# EAGLE board xmos_avb_brd_V4 (EAGLE 9.6.2)
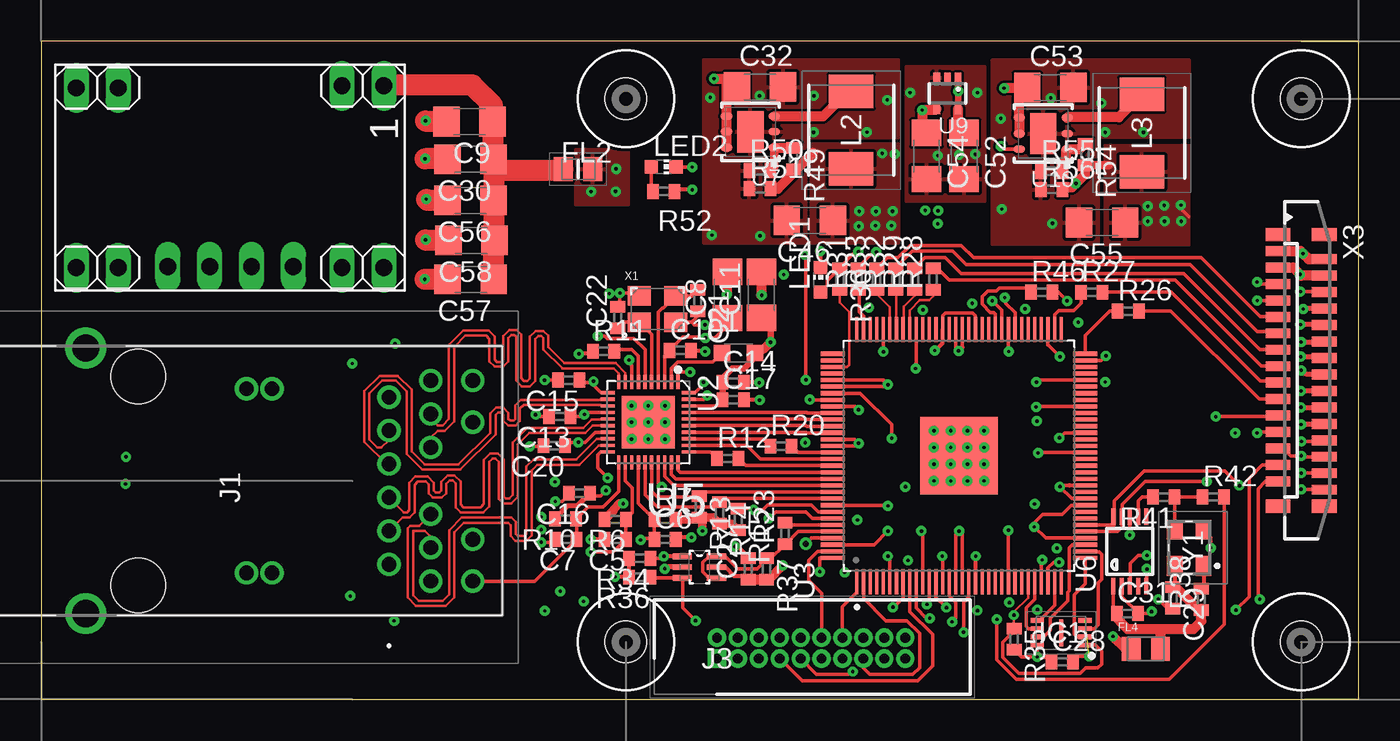
[diagram p4: board, top side]
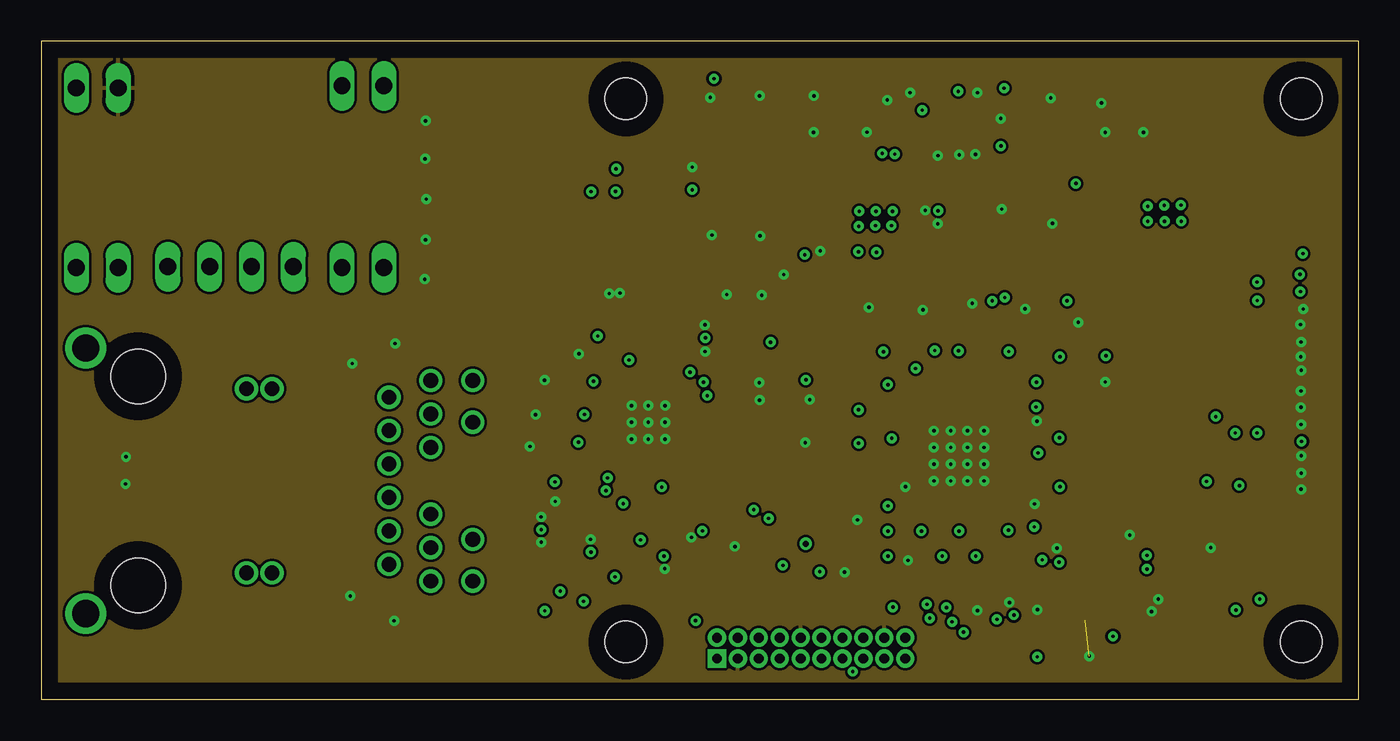
[diagram p5: board, inner layer LAYER2]
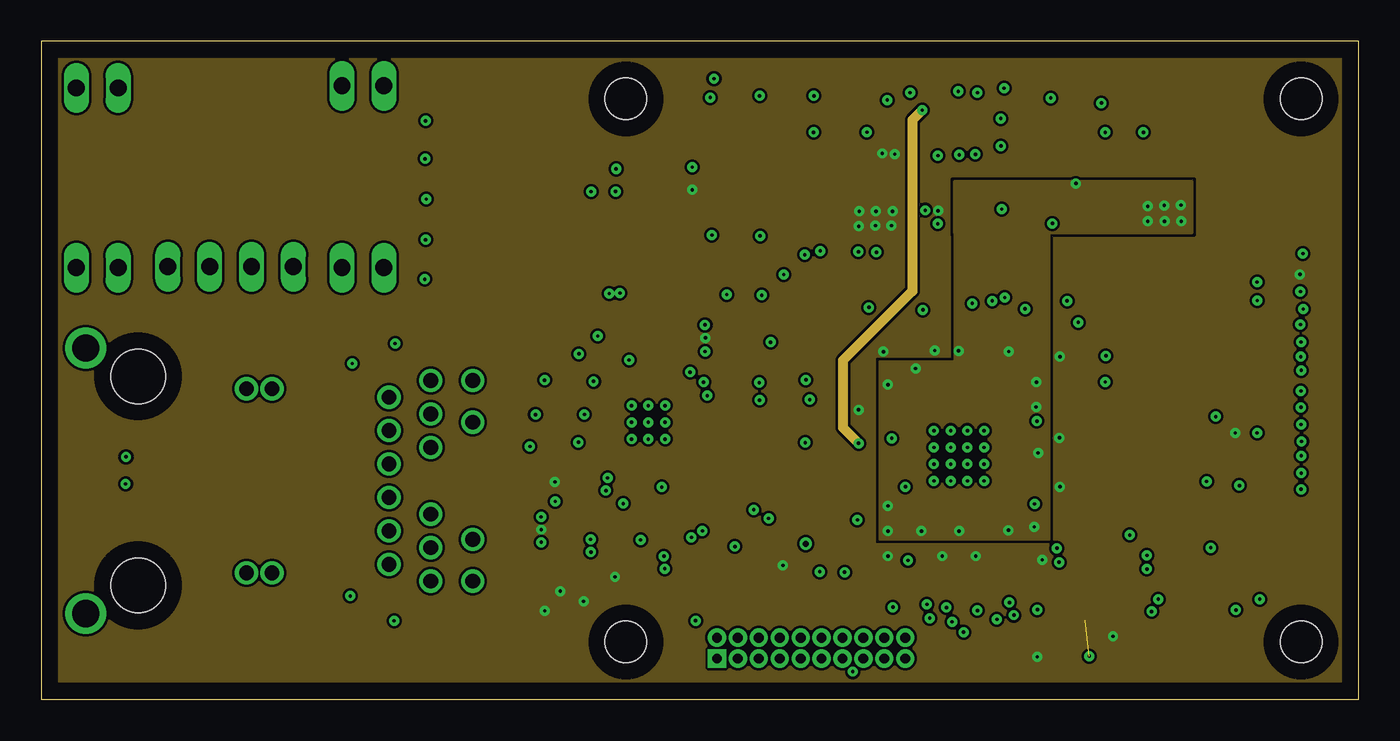
[diagram p6: board, inner layer LAYER15]
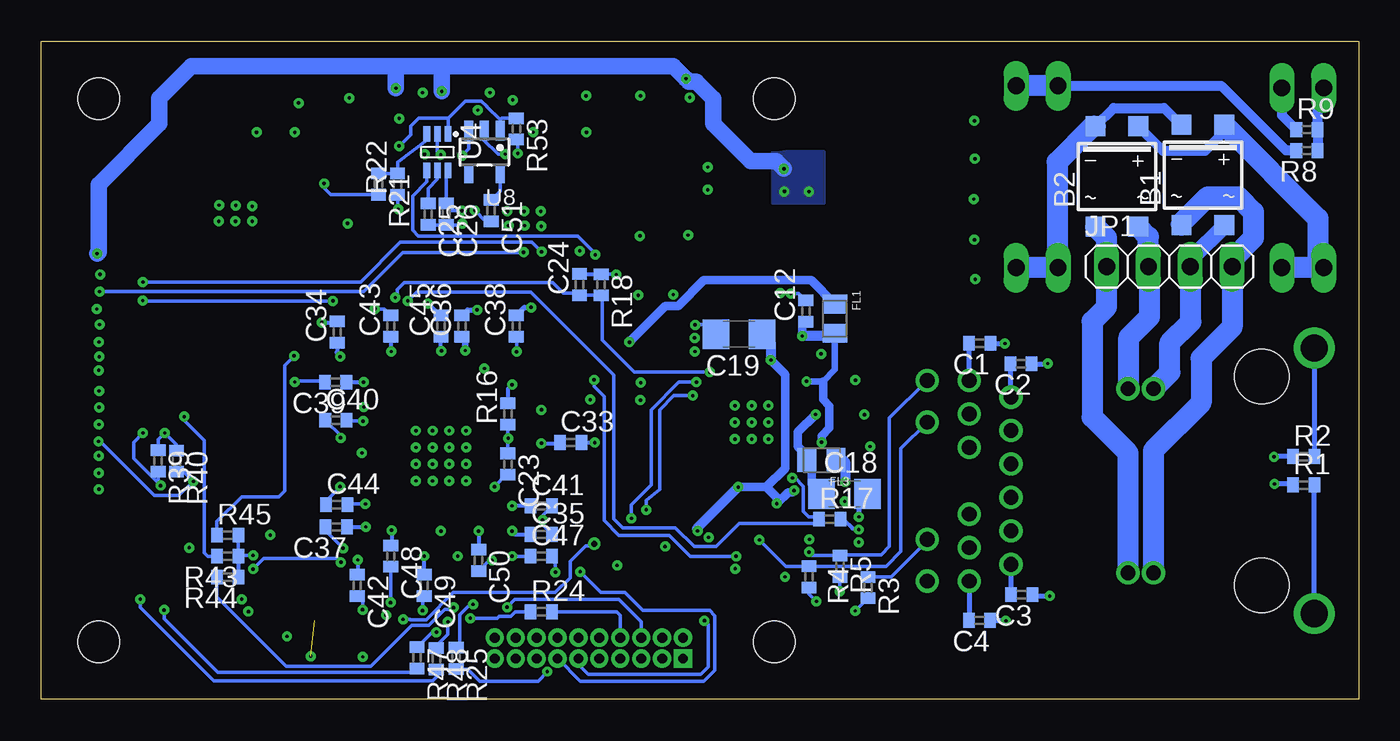
[diagram p7: board, bottom side, seen from below]

Size 80 x 40 mm. Coordinates in mm from the lower left corner, seen from the top.
Outline: 0,0 80,0 80,40 0,40 0,0
Copper layers (1+2*15+16): Top 0.035mm / dielectric 0.14mm / LAYER2 0.035mm / dielectric 1.2mm / LAYER15 0.035mm / dielectric 0.14mm / Bottom 0.035mm
Design rules "4layer_pcbPool *": minimum track width 0.15mm, minimum drill 0.2mm, track to track 6mil, track to pad 6mil, pad to pad 6mil, via to via 6mil, smd to smd 6mil, copper to edge 40mil, drill to drill 8mil, minimum pad ring 10mil, minimum via ring 8mil, stop-mask expansion 4mil, vias tented up to drill 0.7mm, thermal gap 8mil
Net classes: 0 default: width 0.2 mm, drill 0.2 mm; 1 GND: width 0.2 mm, drill 0.2 mm; 2 diff pairs: width 0.15 mm, drill 0.2 mm; 3 PWR: width 0.2 mm, drill 0.2 mm

## Footprints (pad centres in the part's own frame; a part is rotated, then mirrored left to right if it is on the bottom)
RECTIFIER_SOIC-4 = smd 1.2 x 1.2: + 1.3,3.05; - -1.3,3.05; ~1 -1.3,-3.05; ~2 1.3,-3.05
RCL_C0402 = smd 0.7 x 0.9: 1 -0.65,0; 2 0.65,0
RCL_C1206 = smd 1.6 x 1.8: 1 -1.4,0; 2 1.4,0
BLM21AG471SN1D_BEADC2012X105N = smd 1.14 x 1.47: 1 -0.89,0; 2 0.89,0
BLM21PG331SN1D_BEADC2012X105N = smd 1.15 x 1.45: 1 -0.9,0; 2 0.9,0
IS25LP080D-JULE-TR_SON50P300X200X55-9N = smd 0.8 x 0.3: 1 -1.45,0.75; 2 -1.45,0.25; 3 -1.45,-0.25; 4 -1.45,-0.75; 5 1.45,-0.75; 6 1.45,-0.25; 7 1.45,0.25; 8 1.45,0.75 | smd 0.25 x 1.65: 9 0,0
0826-1X1T-KL-F_08261X1TKLF = drill 0.9 pad 1.27: 1 5.08,15.24; 2 3.048,15.24; 3 1.016,15.24; 4 -1.016,15.24; 5 -3.048,15.24; 6 -5.08,15.24; 7 6.096,17.78; 8 4.064,17.78; 9 2.032,17.78; 10 -2.032,17.78; 11 -4.064,17.78; 12 -6.096,17.78; 13 5.59,8.13; 14 -5.59,8.13; 15 5.59,6.59; 16 -5.59,6.59; 17 6.096,20.32; 18 3.556,20.32; 19 -3.556,20.32; 20 -6.096,20.32 | drill 1.65 pad 2.475: MH1 8.065,-3.18; MH2 -8.065,-3.18 | hole 3.3: 6.35,0; -6.35,0
SHDR20W41P127_2X10_1905X559X54 = drill 0.6 pad 1 square: 1 0,0 | drill 0.6 pad 1: 2 0,1.27; 3 1.27,0; 4 1.27,1.27; 5 2.54,0; 6 2.54,1.27; 7 3.81,0; 8 3.81,1.27; 9 5.08,0; 10 5.08,1.27; 11 6.35,0; 12 6.35,1.27; 13 7.62,0; 14 7.62,1.27; 15 8.89,0; 16 8.89,1.27; 17 10.16,0; 18 10.16,1.27; 19 11.43,0; 20 11.43,1.27
PINHEAD_1X04 = drill 1.016 long: 1 -3.81,0; 2 -1.27,0; 3 1.27,0; 4 3.81,0
RCL_L2012C = smd 1 x 1: 1 -1,0; 2 1,0
IHLP2020BZER2R2M11_INDPM5552X200N = smd 2.05 x 2.7: 1 -2.35,0; 2 2.35,0
LED_CHIP-LED0603 = smd 0.8 x 0.8: A 0,-0.75; C 0,0.75
RCL_R0402 = smd 0.7 x 0.9: 1 -0.65,0; 2 0.65,0
AG9900_AG9900LP = drill 1.016 long: 1 -19.939,-3.175; 2 -17.399,-3.175; 3 -3.81,-3.048; 4 -1.27,-3.048; 5 -1.27,7.874; 6 -3.81,7.874; 7 -17.399,7.874; 8 -19.939,7.874
AR8035_QFN40P500X500X75-41N = smd 0.85 x 0.2: 1 -2.45,1.8; 2 -2.45,1.4; 3 -2.45,1; 4 -2.45,0.6; 5 -2.45,0.2; 6 -2.45,-0.2; 7 -2.45,-0.6; 8 -2.45,-1; 9 -2.45,-1.4; 10 -2.45,-1.8; 21 2.45,-1.8; 22 2.45,-1.4; 23 2.45,-1; 24 2.45,-0.6; 25 2.45,-0.2; 26 2.45,0.2; 27 2.45,0.6; 28 2.45,1; 29 2.45,1.4; 30 2.45,1.8 | smd 0.2 x 0.85: 11 -1.8,-2.45; 12 -1.4,-2.45; 13 -1,-2.45; 14 -0.6,-2.45; 15 -0.2,-2.45; 16 0.2,-2.45; 17 0.6,-2.45; 18 1,-2.45; 19 1.4,-2.45; 20 1.8,-2.45; 31 1.8,2.45; 32 1.4,2.45; 33 1,2.45; 34 0.6,2.45; 35 0.2,2.45; 36 -0.2,2.45; 37 -0.6,2.45; 38 -1,2.45; 39 -1.4,2.45; 40 -1.8,2.45 | smd 3.2 x 3.2: 41 0,0
XE216-512-TQ128-C20_QFP40P1600X1600X120-129N = smd 1.47 x 0.2: 1 -7.67,6.2; 2 -7.67,5.8; 3 -7.67,5.4; 4 -7.67,5; 5 -7.67,4.6; 6 -7.67,4.2; 7 -7.67,3.8; 8 -7.67,3.4; 9 -7.67,3; 10 -7.67,2.6; 11 -7.67,2.2; 12 -7.67,1.8; 13 -7.67,1.4; 14 -7.67,1; 15 -7.67,0.6; 16 -7.67,0.2; 17 -7.67,-0.2; 18 -7.67,-0.6; 19 -7.67,-1; 20 -7.67,-1.4; 21 -7.67,-1.8; 22 -7.67,-2.2; 23 -7.67,-2.6; 24 -7.67,-3; 25 -7.67,-3.4; 26 -7.67,-3.8; 27 -7.67,-4.2; 28 -7.67,-4.6; 29 -7.67,-5; 30 -7.67,-5.4; 31 -7.67,-5.8; 32 -7.67,-6.2; 65 7.67,-6.2; 66 7.67,-5.8; 67 7.67,-5.4; 68 7.67,-5; 69 7.67,-4.6; 70 7.67,-4.2; 71 7.67,-3.8; 72 7.67,-3.4; 73 7.67,-3; 74 7.67,-2.6; 75 7.67,-2.2; 76 7.67,-1.8; 77 7.67,-1.4; 78 7.67,-1; 79 7.67,-0.6; 80 7.67,-0.2; 81 7.67,0.2; 82 7.67,0.6; 83 7.67,1; 84 7.67,1.4; 85 7.67,1.8; 86 7.67,2.2; 87 7.67,2.6; 88 7.67,3; 89 7.67,3.4; 90 7.67,3.8; 91 7.67,4.2; 92 7.67,4.6; 93 7.67,5; 94 7.67,5.4; 95 7.67,5.8; 96 7.67,6.2 | smd 0.2 x 1.47: 33 -6.2,-7.67; 34 -5.8,-7.67; 35 -5.4,-7.67; 36 -5,-7.67; 37 -4.6,-7.67; 38 -4.2,-7.67; 39 -3.8,-7.67; 40 -3.4,-7.67; 41 -3,-7.67; 42 -2.6,-7.67; 43 -2.2,-7.67; 44 -1.8,-7.67; 45 -1.4,-7.67; 46 -1,-7.67; 47 -0.6,-7.67; 48 -0.2,-7.67; 49 0.2,-7.67; 50 0.6,-7.67; 51 1,-7.67; 52 1.4,-7.67; 53 1.8,-7.67; 54 2.2,-7.67; 55 2.6,-7.67; 56 3,-7.67; 57 3.4,-7.67; 58 3.8,-7.67; 59 4.2,-7.67; 60 4.6,-7.67; 61 5,-7.67; 62 5.4,-7.67; 63 5.8,-7.67; 64 6.2,-7.67; 97 6.2,7.67; 98 5.8,7.67; 99 5.4,7.67; 100 5,7.67; 101 4.6,7.67; 102 4.2,7.67; 103 3.8,7.67; 104 3.4,7.67; 105 3,7.67; 106 2.6,7.67; 107 2.2,7.67; 108 1.8,7.67; 109 1.4,7.67; 110 1,7.67; 111 0.6,7.67; 112 0.2,7.67; 113 -0.2,7.67; 114 -0.6,7.67; 115 -1,7.67; 116 -1.4,7.67; 117 -1.8,7.67; 118 -2.2,7.67; 119 -2.6,7.67; 120 -3,7.67; 121 -3.4,7.67; 122 -3.8,7.67; 123 -4.2,7.67; 124 -4.6,7.67; 125 -5,7.67; 126 -5.4,7.67; 127 -5.8,7.67; 128 -6.2,7.67 | smd 4.7 x 4.7: 129 0,0
ADM1085AKSZ-REEL7_SOP65P210X95-6N = smd 0.95 x 0.4: 1 -1.1,0.65; 2 -1.1,0; 3 -1.1,-0.65; 4 1.1,-0.65; 5 1.1,0; 6 1.1,0.65
NC7WZ07P6X_SOT65P210X110-6N = smd 1.168 x 0.356: 1 -1.041,0.66; 2 -1.041,0; 3 -1.041,-0.66; 4 1.041,-0.66; 5 1.041,0; 6 1.041,0.66
CS2100-CP_CIRRUS-LOGIC_MSOP10 = smd 0.25 x 1: 1 -1,-2.113; 2 -0.5,-2.113; 3 0,-2.113; 4 0.5,-2.113; 5 1,-2.113; 6 1,2.113; 7 0.5,2.113; 8 0,2.113; 9 -0.5,2.113; 10 -1,2.113
ST-MICROELECTRONICS2_DFN6 = smd 0.45 x 0.7: 1 -0.95,-1.45; 2 0,-1.45; 3 0.95,-1.45; 4 0.95,1.45; 5 0,1.45; 6 -0.95,1.45 | smd 2.5 x 1.6: 7 0,0
ON-SEMI_SOT23-5 = smd 0.55 x 1.2: 1 -0.95,-1.3; 2 0,-1.3; 3 0.95,-1.3; 4 0.95,1.3; 5 -0.95,1.3
MICREL2_SC70-5 = smd 0.4 x 0.6: 1 -0.65,-0.95; 2 0,-0.95; 3 0.65,-0.95; 4 0.65,0.95; 5 -0.65,0.95
DRIL-2,5 = hole 2.5: 0,0
FA-238_OSCCC320X250X70-4N = smd 1.4 x 1.2: 1 -1.1,-0.8; 2 1.1,-0.8; 3 1.1,0.8; 4 -1.1,0.8
CON-MOLEX_52559-3092 = smd 0.6 x 1.5: 1 -7.25,-1.4; 2 -6.75,1.4; 3 -6.25,-1.4; 4 -5.75,1.4; 5 -5.25,-1.4; 6 -4.75,1.4; 7 -4.25,-1.4; 8 -3.75,1.4; 9 -3.25,-1.4; 10 -2.75,1.4; 11 -2.25,-1.4; 12 -1.75,1.4; 13 -1.25,-1.4; 14 -0.75,1.4; 15 -0.25,-1.4; 16 0.25,1.4; 17 0.75,-1.4; 18 1.25,1.4; 19 1.75,-1.4; 20 2.25,1.4; 21 2.75,-1.4; 22 3.25,1.4; 23 3.75,-1.4; 24 4.25,1.4; 25 4.75,-1.4; 26 5.25,1.4; 27 5.75,-1.4; 28 6.25,1.4; 29 6.75,-1.4; 30 7.25,1.4 | smd 0.8 x 1.5: M1 -8.25,-1.4; M2 8.25,-1.4; M3 8.25,1.4; M4 -8.25,1.4
ECS-3225Q-33-240-DP-TR_ECS3225Q33240DPTR = smd 1.2 x 0.95: 1 -1.1,-0.875; 2 1.1,-0.875; 3 1.1,0.875; 4 -1.1,0.875

## Placement (x,y rotation side)
B1  RECTIFIER_MB1S  [RECTIFIER_SOIC-4]  9.47,31.87 0 bottom
B2  RECTIFIER_MB1S  [RECTIFIER_SOIC-4]  14.69,31.78 0 bottom
C1  100n  [RCL_C0402]  23.01,21.64 180 bottom
C2  100n  [RCL_C0402]  20.51,20.4 180 bottom
C3  100n  [RCL_C0402]  20.47,6.37 180 bottom
C4  100n  [RCL_C0402]  23.03,4.81 180 bottom
C5  470p  [RCL_C0402]  34.85,9.73 180 top
C6  470p  [RCL_C0402]  37.88,9.73 0 top
C7  470p  [RCL_C0402]  31.86,9.73 180 top
C8  10u  [RCL_C1206]  41.67,24.58 90 top
C9  1u  [RCL_C1206]  26.01,35.11 180 top
C10  100n  [RCL_C0402]  38.81,21.21 0 top
C11  10u  [RCL_C1206]  43.72,24.59 90 top
C12  100n  [RCL_C0402]  33.57,23.59 90 bottom
C13  100n  [RCL_C0402]  31.49,17.2 180 top
C14  100n  [RCL_C0402]  42.02,19.28 0 top
C15  100n  [RCL_C0402]  32.04,19.41 180 top
C16  100n  [RCL_C0402]  32.68,12.54 180 top
C17  100n  [RCL_C0402]  42.02,18.21 0 top
C18  1u  [RCL_C1206]  31.23,12.49 0 bottom
C19  1u  [RCL_C1206]  37.64,22.2 180 bottom
C20  100n  [RCL_C0402]  31.15,15.43 180 top
C21  27p  [RCL_C0402]  39.87,24.24 270 top
C22  27p  [RCL_C0402]  35,23.22 90 top
C23  100n  [RCL_C0402]  51.66,14.3 270 bottom
C24  100n  [RCL_C0402]  47.32,25.22 90 bottom
C25  1n  [RCL_C0402]  56.5,29.48 270 bottom
C26  100n  [RCL_C0402]  55.41,29.49 270 bottom
C27  100n  [RCL_C0402]  42.93,7.93 90 top
C28  100n  [RCL_C0402]  61.99,2.29 0 top
C29  100n  [RCL_C0402]  68.71,6.17 270 top
C30  1u  [RCL_C1206]  26.06,32.82 180 top
C31  100n  [RCL_C0402]  65.96,5.23 0 top
C32  4u7  [RCL_C1206]  43.64,37.21 0 top
C33  100n  [RCL_C0402]  47.85,15.62 0 bottom
C34  100n  [RCL_C0402]  62.03,22.33 90 bottom
C35  100n  [RCL_C0402]  49.63,10.03 0 bottom
C36  100n  [RCL_C0402]  54.46,22.68 90 bottom
C37  100n  [RCL_C0402]  62.08,10.49 180 bottom
C38  100n  [RCL_C0402]  51.16,22.68 90 bottom
C39  100n  [RCL_C0402]  62.13,19.28 180 bottom
C40  100n  [RCL_C0402]  62.1,16.97 0 bottom
C41  100n  [RCL_C0402]  49.63,11.76 0 bottom
C42  100n  [RCL_C0402]  60.81,6.93 270 bottom
C43  100n  [RCL_C0402]  58.78,22.68 90 bottom
C44  100n  [RCL_C0402]  62.05,11.84 0 bottom
C45  100n  [RCL_C0402]  55.73,22.68 90 bottom
C46  22u  [RCL_C1206]  46.67,29.1 180 top
C47  100n  [RCL_C0402]  49.63,8.71 0 bottom
C48  100n  [RCL_C0402]  58.78,8.71 270 bottom
C49  100n  [RCL_C0402]  56.74,6.93 270 bottom
C50  100n  [RCL_C0402]  53.44,8.46 270 bottom
C51  1n  [RCL_C0402]  52.68,29.7 270 bottom
C52  1u  [RCL_C1206]  56.04,33.02 270 top
C53  4u7  [RCL_C1206]  61.27,37.18 0 top
C54  1u  [RCL_C1206]  53.75,33.02 270 top
C55  22u  [RCL_C1206]  64.42,28.98 180 top
C56  1u  [RCL_C1206]  26.07,30.32 180 top
C57  1u  [RCL_C1206]  26.08,25.52 180 top
C58  1u  [RCL_C1206]  26.12,27.89 180 top
FL1  BLM21AG471SN1D_BLM21AG471SN1D  [BLM21AG471SN1D_BEADC2012X105N]  31.81,23.14 270 bottom
FL2  BLM21PG331SN1D_BLM21PG331SN1D  [BLM21PG331SN1D_BEADC2012X105N]  32.6,32.22 180 top
FL3  BLM21AG471SN1D_BLM21AG471SN1D  [BLM21AG471SN1D_BEADC2012X105N]  32.63,14.56 180 bottom
FL4  BLM21AG471SN1D_BLM21AG471SN1D  [BLM21AG471SN1D_BEADC2012X105N]  67.07,3.07 0 top
IC1  IS25LP080D-JULE-TR_IS25LP080D-JULE-TR  [IS25LP080D-JULE-TR_SON50P300X200X55-9N]  61.93,4.06 180 top
J1  0826-1X1T-KL-F_0826-1X1T-KL-F  [0826-1X1T-KL-F_08261X1TKLF]  5.88,13.29 270 top
J3  ESHF-110-01-L-D-TH  [SHDR20W41P127_2X10_1905X559X54]  41.03,2.49 0 top
JP1  [PINHEAD_1X04]  11.5,26.3 0 bottom
L1  4u7  [RCL_L2012C]  42.34,21.05 0 top
L2  IHLP2020BZER2R2M11_IHLP2020BZER2R2M11  [IHLP2020BZER2R2M11_INDPM5552X200N]  49.18,34.59 270 top
L3  IHLP2020BZER2R2M11_IHLP2020BZER2R2M11  [IHLP2020BZER2R2M11_INDPM5552X200N]  66.83,34.41 270 top
LED1  gre  [LED_CHIP-LED0603]  47.32,25.5 0 top
LED2  gre  [LED_CHIP-LED0603]  37.79,32.36 270 top
R1  0  [RCL_R0402]  3.35,13.03 0 bottom
R2  0  [RCL_R0402]  3.34,14.76 0 bottom
R3  510  [RCL_R0402]  29.8,6.8 270 bottom
R4  510  [RCL_R0402]  33.38,7.45 270 bottom
R5  510  [RCL_R0402]  31.5,8.1 270 bottom
R6  10k  [RCL_R0402]  34.85,10.95 180 top
R7  10k  [RCL_R0402]  37.88,10.95 0 top
R8  [RCL_R0402]  3.15,33.35 180 bottom
R9  [RCL_R0402]  3.15,34.62 0 bottom
R10  10k  [RCL_R0402]  31.83,10.97 180 top
R11  2k37  [RCL_R0402]  34.14,21.16 0 top
R12  33  [RCL_R0402]  41.67,14.65 0 top
R13  10k  [RCL_R0402]  39.96,11.71 270 top
R14  10k  [RCL_R0402]  41.18,11.33 270 top
R15  1k5  [RCL_R0402]  42.32,10.95 270 top
R16  4R7  [RCL_R0402]  51.66,17.35 90 bottom
R17  10k  [RCL_R0402]  32.12,10.96 0 bottom
R18  10k  [RCL_R0402]  46,25.2 270 bottom
R20  33  [RCL_R0402]  44.92,15.39 0 top
R21  3k9  [RCL_R0402]  59.52,31.33 270 bottom
R22  10k  [RCL_R0402]  58.37,31.31 90 bottom
R23  0  [RCL_R0402]  45.16,10.08 90 top
R24  33  [RCL_R0402]  49.63,5.34 0 bottom
R25  33  [RCL_R0402]  54.81,2.5 270 bottom
R26  33  [RCL_R0402]  66,23.59 0 top
R27  33  [RCL_R0402]  63.78,24.75 0 top
R28  33  [RCL_R0402]  54.15,25.55 90 top
R29  33  [RCL_R0402]  53.04,25.55 90 top
R30  1k  [RCL_R0402]  48.49,25.55 270 top
R31  0  [RCL_R0402]  49.61,25.55 90 top
R32  0  [RCL_R0402]  51.89,25.55 90 top
R33  0  [RCL_R0402]  50.72,25.55 90 top
R34  10k  [RCL_R0402]  36.33,8.58 180 top
R35  1k  [RCL_R0402]  59.07,3.67 270 top
R36  10k  [RCL_R0402]  36.33,7.44 180 top
R37  10k  [RCL_R0402]  44.04,7.93 270 top
R38  10k  [RCL_R0402]  70.43,6.1 90 top
R39  2k2  [RCL_R0402]  72.9,14.5 270 bottom
R40  2k2  [RCL_R0402]  71.79,14.48 270 bottom
R41  33  [RCL_R0402]  68.16,12.3 180 top
R42  33  [RCL_R0402]  71.17,12.31 0 top
R43  33  [RCL_R0402]  68.68,8.71 180 bottom
R44  33  [RCL_R0402]  68.68,7.44 180 bottom
R45  33  [RCL_R0402]  68.68,9.98 0 bottom
R46  0  [RCL_R0402]  60.75,24.75 0 top
R47  33  [RCL_R0402]  57.18,2.52 270 bottom
R48  0  [RCL_R0402]  56.01,2.48 270 bottom
R49  18k  [RCL_R0402]  45.68,32.86 270 top
R50  5k6  [RCL_R0402]  43.64,32.13 0 top
R51  2k2  [RCL_R0402]  43.64,31.04 0 top
R52  1k  [RCL_R0402]  37.81,30.87 0 top
R53  10k  [RCL_R0402]  51.15,34.67 270 bottom
R54  4k7  [RCL_R0402]  63.38,33.12 270 top
R55  18k  [RCL_R0402]  61.35,32.08 0 top
R56  1k  [RCL_R0402]  61.35,30.98 0 top
U1  AG9900_AG9905LP  [AG9900_AG9900LP]  0.86,34.11 180 top
U2  AR8035_AR8035-AL1A-R  [AR8035_QFN40P500X500X75-41N]  36.86,16.84 270 top
U3  XE216-512-TQ128-C20_XE216-512-TQ128-C20  [XE216-512-TQ128-C20_QFP40P1600X1600X120-129N]  55.73,14.81 90 top
U4  ADM1085AKSZ-REEL7_ADM1085AKSZ-REEL7  [ADM1085AKSZ-REEL7_SOP65P210X95-6N]  55.94,33.26 270 bottom
U5  NC7WZ07P6X_NC7WZ07P6X  [NC7WZ07P6X_SOT65P210X110-6N]  39.96,8.05 0 top
U6  CS2100-CP_CS2100-CP-CZZ  [CS2100-CP_CIRRUS-LOGIC_MSOP10]  66.1,9 0 top
U7  ST-MICROELECTRONICS2_ST1S06PUR  [ST-MICROELECTRONICS2_DFN6]  43.06,34.49 90 top
U8  NCP303LSN30  [ON-SEMI_SOT23-5]  53.09,33.26 180 bottom
U9  MIC5213-2.5V  [MICREL2_SC70-5]  55.02,36.83 180 top
U10  ST-MICROELECTRONICS2_ST1S06PUR  [ST-MICROELECTRONICS2_DFN6]  60.84,34.39 90 top
U$4  [DRIL-2,5]  35.5,3.5 0 top
U$5  [DRIL-2,5]  35.5,36.5 0 top
U$6  [DRIL-2,5]  76.5,3.5 0 top
U$7  [DRIL-2,5]  76.5,36.5 0 top
X1  FA-238 25.000  [FA-238_OSCCC320X250X70-4N]  37.42,23.73 0 top
X3  CON-MOLEX_52559-3092  [CON-MOLEX_52559-3092]  76.5,20 270 top
Y1  ECS-3225Q-33-240-DP-TR_ECS-3225Q-33-240-DP-TR  [ECS-3225Q-33-240-DP-TR_ECS3225Q33240DPTR]  69.7,9.22 90 top

## Tracks (layer width: path | path; a pad name or v marks a point on that pad's centre or on a via)
1V0  (via drill 0.2, 0.2 pad 0.25)
  Top 0.2: U3.36 60.98,9.81 | U3.120 51.36,11.81 | U3.17 55.93,10.04 v55.73,10.24 55.53,10.04 U3.16 | U3.41 62.55,11.8 62.01,11.25 60.81,11.25 60.3,10.74 v60.3,10.49 | 51.13,19.41 U3.101 | U3.102 51.29,19.01 | U3.49 60.55,15.01 | 69.2,29.03 v69.22,29.05 | 69.69,29.34 69.2,29.83 v69.2,30.04
  Top 0.203: U3.126 50.58,9.41 v51.41,10.24 | U3.11 53.53,10.15 v53.44,10.24 | U3.24 v58.73,10.28 v58.73,10.29 | U3.73 58.73,21.15 v58.74,21.14 | U3.80 55.93,21.41 | U3.81 55.53,21.36 v55.7,21.18 | U3.87 53.13,20.43 53.09,20.41 v53.09,20.12 | U3.60 60.56,19.41 v60.43,19.28 | U3.56 60.43,17.81 v60.4,17.78 | 60.98,9.81 v60.3,10.49
  Top 0.24: 51.36,11.81 v51.41,11.76 | 51.13,19.41 v51.41,19.13 51.29,19.01 | 60.55,15.01 v60.53,14.99
  Top 0.254: 55.93,21.41 v55.7,21.18
  Top 0.508: R54.2 64.81,32.47
  Top 0.61: R56.2 62.13,31.12 62.59,31.12 v62.83,31.36 63.38,31.91 R54.2 63.4,32.48
  Bottom 0.2: R21.2 62.43,30.68 62.83,31.07 v62.83,31.36
  Bottom 0.24: C37.1 v60.3,10.49 | v51.41,19.13 51.66,18.87 R16.2 | v58.73,10.29 58.73,9.41 C48.1 | v53.44,10.24 C50.1 | C43.1 58.78,21.17 v58.74,21.14 | C39.1 v60.43,19.28 | v55.7,21.18 55.73,21.21 C45.1 | C41.1 v51.41,11.76 | v51.41,10.24 51.21,10.03 C35.1
  other vias: 67.19,29.97 67.19,29.05 68.18,30.02 68.21,29.05
  pour Top: 64.6,33.63 64.6,27.66 69.68,27.66 69.68,33.63
  pour LAYER15: 55.47,30.81 55.47,20.52 50.9,20.52 50.9,9.73 61.21,9.73 61.21,30.81
  pour LAYER15: 55.47,31.46 69.87,31.46 69.87,28.37 55.47,28.37
1V1  (via drill 0.2)
  Top 0.203: U2.38 40.99,17.84 C17.1
  Top 0.305: L1.2 43.34,20.77
  Top 0.406: C17.1 C14.1 41.37,19.53 41.95,20.12 42.69,20.12 43.34,20.77 | C11.1 44.29,22.62 v44.29,21.71 v44.28,21.71
  Top 0.508: L1.2 43.34,21.2 43.4,21.26 43.84,21.26 v44.28,21.71
  Bottom 0.508: v44.28,21.71 42.1,23.89 41.34,23.89 39.76,25.47 33.25,25.47 FL1.1
2V5  (via drill 0.2 pad 0.25)
  Top 0.2: U3.111 49.46,15.4 v49.63,15.57 49.39,15.81 U3.110
  Top 0.61: U9.4 54.31,35.81 v53.5,35.81 53.5,34.67 C54.1
  LAYER15 0.61: v53.5,35.81 52.89,35.2 52.89,24.82 48.68,20.61 48.68,16.52 v49.63,15.57
  Bottom 0.24: v49.63,15.57 48.55,15.57 C33.1
3V3  (via drill 0.2, 0.2 pad 0.2, 0.2 pad 0.25)
  Top 0.2: 62.43,13.01 61.92,13.01 | U3.44 62.44,13.01 | U3.105 49.43,17.81 v49.63,17.6 | U3.78 56.72,23.32 56.56,23.49 54.9,23.49 54.73,23.32 U3.83 54.72,21.64 | 60.73,8.43 U3.29 | U3.67 61.13,21.55 61.15,21.52 | U2.3 37.86,20.91 C10.1 38.96,22.01 40.29,22.01 v40.33,21.98 40.9,21.98 41.67,22.74 | IC1.8 v60.48,2.6 v60.47,2.6 59.5,2.6 R35.2
  Top 0.203: U3.6 51.53,8.59 v51.41,8.71 | U3.14 54.73,8.7 v54.71,8.71 | v51.14,21.13 51.13,21.15 U3.92 | U3.42 62.57,12.21 v61.85,12.93 | U3.52 62.13,16.21 v61.82,15.9 | 61.15,21.52 v61.85,20.83
  Top 0.24: U3.19 56.73,8.7 v56.74,8.71 | 62.44,13.01 62.43,13.01 | v61.85,12.93 61.92,13.01 | R34.2 R36.2 v34.84,7.45 | v39.52,30.97 38.56,30.97 R52.2 | v54.25,21.21 54.29,21.21 54.72,21.64 | C27.1 42.72,7.49 42.09,7.49 41.53,8.05 U5.5 41.48,8.05 | v60.78,8.48 60.73,8.43 | 41.67,22.74 C8.1 41.58,23.18 | 61.23,2.4 C28.1 61.03,2.6 v60.47,2.6 | R35.2 59.03,3.02 58.8,3.26
  Top 0.254: C8.1
  Top 0.508: R37.2 44.16,7.28 v45.03,8.15
  Top 0.61: R51.2 44.73,31.04 45.68,31.98 R49.2 45.86,32.21 46.87,33.22 | C8.1 41.58,23.09 | X3.4 76.5,25.75 v76.42,25.82 76.42,25.84 76.01,26.25 X3.3 | FL4.1 65.84,3.07 v65.08,3.83 | R37.2 C27.1
  Bottom 0.2: v61.85,12.93 62.79,11.99 | v54.45,29.69 55.1,29.69 55.41,30 C26.1 55.41,32.04 U4.6 | v31.52,6.58 31.52,7.43 R5.2 | R4.2 33.38,6.41 v32.93,5.96 | v30.57,5.39 R3.2 | R40.1 71.79,15.49 v72.5,16.2 72.9,15.8 R39.1 | v51.83,33.14 52.26,33.14 53.15,34.03 53.09,34.08 U8.2 | R53.2 51.07,34.02 v51.07,33.18
  Bottom 0.203: v61.82,15.9 61.76,15.97 C40.1 | 62.79,11.99 62.65,11.85 C44.1 | C47.1 v51.41,8.71 | C38.1 51.14,22.02 v51.14,21.13
  Bottom 0.24: C49.1 v56.74,8.71 | v60.78,8.48 60.78,7.61 C42.1 | C34.1 62.03,21.13 62.07,21.09 61.85,20.86 v61.85,20.83 | R17.2 31.3,10.96 30.73,10.39 30.43,10.39 v30.36,10.32
  Bottom 0.406: C36.1 54.25,21.83 v54.25,21.21
  Bottom 0.61: FL3.1 31.3,14.56 31.19,14.44 v31.19,13.22
  other vias: 49.64,28.75 50.68,29.66 49.66,29.66 51.7,29.66 50.65,28.8 51.62,28.8
  pour Top: 46.79,33.75 52.03,33.75 52.03,27.73 46.79,27.73
  pour LAYER15 (rank 2): -0.1,40.21 -0.1,-0.43 80.37,-0.43 80.37,40.21
3V3_PG  (via drill 0.2)
  Top 0.2: U10.6 58.43,33.44 58.27,33.6 v58.27,33.63
  Bottom 0.2: U4.1 55.28,35.32 | 55.28,35.32 54.24,36.37 53.27,36.37 52.94,36.04 52.94,36.03 52.14,35.23 | 52.14,35.23 U8.1 | R53.1 52.05,35.32 52.14,35.23 | v58.27,33.63 57.57,34.33 57.57,34.82 57.07,35.32 55.28,35.32 | 55.28,35.32
3V3A
  Top 0.2: C31.1 65.1,5.44 U6.1
  Top 0.24: Y1.4 68.82,6.94 C29.1
  Top 0.508: 65.52,4.73 65.31,4.94 C31.1
  Top 0.61: C29.1 68.88,6.82 70.32,5.38 70.46,5.52 70.48,5.5 R38.1 70.43,4.76 69.97,4.29 67.82,4.29 | 65.52,4.73 65.95,4.29 67.82,4.29 | FL4.2 67.96,4.15 67.82,4.29
5V0  (via drill 0.2)
  Top 0.406: v55.68,36.95 55.68,37.77 U9.1 U9.5
  Top 0.61: 41.61,37.21 U7.4 U7.5 U7.6 | 41.61,37.21 41.61,37.72 v40.85,37.72 | 41.61,37.21 C32.1 | U10.5 U10.4 59.39,36.7 C53.1 59.83,37.14 v58.46,37.14 | C52.1 55.67,34.78 U9.5 | X3.2 76.94,26.75 v76.6,27.09 76.44,27.25 X3.1
  Bottom 1.016: 55.64,38.48 41.61,38.48 v40.85,37.72 40.67,37.54 40.22,37.54 39.18,36.5 39.18,34.97 36.93,32.72 35.38,32.72 v34.9,32.24 | 55.64,38.48 55.68,38.43 v55.68,36.95 | 55.64,38.48 58.44,38.48 | 58.44,38.48 58.46,38.46 v58.46,37.14 | 58.44,38.48 70.89,38.48 72.82,36.55 72.82,34.97 76.51,31.28 76.51,27.18 v76.6,27.09
  other vias: 34.87,30.87 33.39,30.86
  pour Bottom: 32.49,30.17 35.59,30.17 35.59,33.3 32.49,33.3
  pour Top: 32.45,30.08 35.64,30.08 35.64,33.4 32.45,33.4
24M_CLK  (via drill 0.2, 0.35)
  Top 0.2: R42.2 71.82,4.57 68.5,1.24 59.2,1.24 58.02,2.42 58.02,4.86 v58.03,4.87 | v46.42,9.46 46.77,9.81 | 46.77,9.81 46.83,9.81 | 46.77,9.81
  Top 0.203: U3.125 46.77,9.81
  Bottom 0.2: v46.42,9.46 46.55,9.33 46.94,9.33 47.89,8.38 47.89,7.39 48.78,6.5 49.44,6.5 49.45,6.5 54.97,6.5 56.62,4.86 57.59,4.86 57.58,4.87 v58.03,4.87
ADC_RST_N
  Top 0.203: U3.95 49.93,23.29 49.67,23.55 49.67,24.84 R31.1
ADC_RST_N_OUT  (via drill 0.2)
  Top 0.2: X3.6 77.85,24.79 v76.45,24.79
  Top 0.203: v50.71,27.18 50.51,27.18 49.61,26.27 R31.2
  Bottom 0.2: v76.45,24.79 60.41,24.79 58.05,27.15 50.74,27.15 v50.71,27.18
AVDD33  (via drill 0.2)
  Top 0.2: U2.14 33.1,17.44 v32.98,17.32 32.86,17.2 C13.1
  Bottom 0.508: C18.1 33.21,13.07 33.21,14.41 33.47,14.58 FL3.2 33.52,14.97 33.66,14.97 34.06,15.38 34.06,16.25 v32.98,17.32
AVDDL  (via drill 0.2)
  Top 0.2: U2.11 33.98,18.64 33.53,19.09 v33.53,19.33 33.46,19.25 32.84,19.25 C15.1 | 34.38,21.93 34.22,22.09 v33.8,22.09 | U2.17 33.64,16.24 33.04,15.63 v32.62,15.63 32.19,15.63 31.98,15.43 C20.1
  Top 0.203: U2.6 36.66,21.25 35.99,21.93 34.38,21.93
  Bottom 0.406: v33.53,19.33 32.51,19.33 31.81,20.04 FL1.2
  Bottom 0.508: 32.51,19.33 32.51,18.22 32.14,17.85 32.14,16.5 32.62,16.02 v32.62,15.63 | v33.8,22.09 33.8,22.72 C12.1
  Bottom 0.61: v33.8,22.09 33.78,22.11 31.95,22.11 FL1.2
GND  (via drill 0.2, 0.2 pad 0.25)  (1 unrouted)
  Top 0.2: U3.104 46.74,18.21 | C13.2 30.12,17.2 v30.01,17.31 | C15.2 31.37,19.42 30.58,19.42 v30.56,19.41 | X3.30 77.88,12.77 v76.49,12.77 | X3.26 76.56,14.75 v76.5,14.81 v76.49,14.8 75.88,14.8 75.43,15.25 X3.25 | X3.28 76.38,13.76 76.33,13.71 76.45,13.71 v76.5,13.76 | X1.4 36.15,24.7 36.13,24.7 v35.14,24.7 35.14,24 C22.2 | 39.49,22.93 39.87,23.3 C21.2 | X1.2 39.49,22.93 | U6.2 65.62,6.87 65.62,6.25 | 66.72,5.23 67.3,5.23 v67.42,5.35 | 39.49,22.93 39.65,22.76 v40.3,22.76 | U6.8 v66.1,10 v66.09,9.99
  Top 0.203: C54.2 53.38,31.62 | U9.3 54.36,37.77 | C29.2 68.39,5.52 v67.82,6.1 | v63.63,2.64 62.99,2.64 C28.2 | C31.2 66.61,5.25 65.62,6.25 | C16.2 32.03,12.44 31.64,12.04 v31.21,12.04 | C7.2 31.04,9.73 30.87,9.56 v30.36,9.56 | v39.53,32.34 38.57,32.34 LED2.C | Y1.2 70.57,10.3 71.02,9.86 v71.02,9.22 | C20.2 30.31,15.43 30.26,15.37 v29.67,15.37
  Top 0.24: 46.74,18.21 46.69,18.25 v46.66,18.22 | C31.2 66.72,5.23 | 68.56,5.52 C29.2 | v47.3,27.25 47.32,27.23 LED1.C | C17.2 43.59,18.21 v43.62,18.19 | v43.59,19.25 42.69,19.25 C14.2 | R11.1 33.37,21.03 32.67,21.03 v32.65,21.01 | C27.2 42.93,8.65 42.28,9.3 v42.12,9.3 | v39.48,9.86 38.66,9.86 C6.2 | C5.2 v33.36,9.73 | v40.31,21.14 40.24,21.21 C10.2
  Top 0.305: U5.2 38.03,8.05 38.01,8.02 37.93,8.02 v37.86,7.95 | X3.8 76.61,23.75 v76.63,23.72 | X3.10 77.86,22.79 77.72,22.8 77.7,22.78 v76.45,22.78 | v76.49,21.72 78.02,21.72 77.98,21.75 X3.12 | X3.14 77.84,20.8 77.42,20.83 v76.48,20.83 | X3.16 76.82,19.75 76.57,20 v76.5,20 | X3.18 v76.49,18.75 | X3.20 77.87,17.72 76.52,17.72 v76.48,17.75 | X3.22 77.87,16.72 v76.49,16.72
  Top 0.508: U3.129 v55.22,14.3
  Top 0.61: 41.67,26.23 C8.2 41.63,25.94 v41.63,24.61 | C11.2 43.7,25.97 43.7,24.56 v43.75,24.56 | 56.04,31.24 C52.2 | 53.75,31.24 C54.2
  Top 1.27: C9.2 23.39,35.11 v23.34,35.16 | C30.2 24.63,32.85 v23.31,32.85 | C56.2 23.46,30.32 v23.38,30.4 | C58.2 23.39,27.89 v23.34,27.94 | C57.2 23.31,25.52 v23.29,25.54
  Bottom 0.2: R18.1 45.12,25.85 v45.09,25.82 | v40.3,22.76 v40.29,22.77 39.61,22.77 C19.2 | v34.49,24.67 34.01,24.67 34.01,24.68 C12.2 | U4.2 55.94,33.29 v55.74,33.09 | R22.1 58.37,29.84 v58.32,29.79 | C25.2 C26.2 54.43,28.84 v54.43,28.9 | C51.2 53,29.05 v53.67,29.72 | C41.2 49.56,11.19 v49.56,10.91 49.56,10.61 C35.2 | U8.3 54.04,33.56 54.03,33.55 54.03,33.46 v54.44,33.05 | C48.2 v58.78,5.89 | C37.2 62.73,10.25 v61.67,9.2 | C45.2 56.46,24.06 v56.53,24.06 | C39.2 62.87,19.37 64.52,19.37 v64.6,19.29 | C43.2 59.18,23.73 v59.73,23.73
  Bottom 0.203: 51.55,13.54 C23.2 51.78,13.65 52.48,12.95 v52.48,12.93 | C50.2 52.79,8.46 v52.63,8.46 | v56.84,5.41 56.84,6.27 56.84,6.28 C49.2 | C40.2 61.17,16.97 61.14,16.93 60.47,16.93 v60.45,16.92 | C42.2 60.49,6.28 v60.49,5.46 | C44.2 61.4,11.89 v60.31,11.89 | C47.2 48.77,8.51 v48.77,7.73
  Bottom 0.24: C24.2 47.3,25.85 R18.1 | C33.2 47.19,15.61 v46.39,15.61 | v62.97,22.91 62.09,22.91 C34.2
  Bottom 0.305: 29.96,12.36 C18.2 30.35,11.97 v30.35,11.09 | R2.1 v5.14,14.76 v5.15,14.75 | R1.1 4.07,13.1 v5.12,13.1 | C4.1 21.46,4.81 v21.43,4.78 | C3.1 19.74,6.29 v18.76,6.29 | C1.1 v21.5,21.64 v21.49,21.63 | C2.1 v18.9,20.4 v18.89,20.41 | C36.2 54.12,23.67 v53.53,23.67 | C38.2 50.66,23.82 v50.26,23.82
  Bottom 0.61: R9.1 4.67,35.49 U1.3
  other vias: 36.86,17.86 35.85,17.86 35.85,16.84 35.85,15.82 36.86,15.82 37.88,15.82 37.88,16.84 36.86,16.84 37.88,17.86 52.75,36.87 51.37,36.42 55.22,15.32 56.24,15.32 57.25,16.33 57.25,15.32 55.22,13.28 54.2,13.28 54.2,14.3 54.2,16.33 55.22,16.33 56.24,16.33 54.2,15.32 56.24,14.3 57.25,14.3 57.25,13.28 56.24,13.28 58.26,35.3 50.14,34.47 64.6,34.46 46.9,34.46 61.3,36.55 61.4,28.93 43.64,28.16 43.62,36.67 66.92,34.46 40.62,36.57 56.72,33.12 64.37,36.24 46.92,36.67 56.84,36.87 40.72,28.22
  pour LAYER2: -0.49,40.46 -0.49,-0.43 80.62,-0.43 80.62,40.46
  pour Top: 52.05,34.14 52.05,38.99 40.24,38.99 40.24,27.73 46.41,27.73 46.41,34.14
  pour Top: 69.7,34.16 69.7,38.83 57.74,38.83 57.74,27.68 64.17,27.68 64.17,34.16
  pour Top: 52.51,30.27 57.28,30.27 57.28,38.45 52.51,38.45
GPIO_IN  (via drill 0.2)
  Top 0.2: v62.29,24.22 61.76,24.75 R46.2 | v73.84,24.23 73.85,24.25 X3.7
  Bottom 0.2: v62.29,24.22 73.82,24.22 v73.84,24.23
GPIO_OUT  (via drill 0.2)
  Top 0.2: X3.5 73.94,25.25 v73.83,25.37
  Top 0.203: v49.62,27.2 49.44,27.2 48.49,26.25 R30.1 47.73,25.44 47.73,25.16 LED1.A
  Bottom 0.2: v49.62,27.2 49.64,27.2 50.23,27.79 58.19,27.79 60.61,25.37 v73.83,25.37
LRCK_OUT
  Top 0.2: R26.2 68.6,23.59 73.94,18.25 X3.19
LRCLK
  Top 0.2: R26.1 64.88,23.59 63.4,22.11 U3.64
MCLK_AUDIO  (via drill 0.2)
  Top 0.2: X3.21 75.04,17.19 v71.31,17.19
  Bottom 0.2: R43.2 69.89,8.71 70.09,8.91 70.09,15.74 71.31,16.96 v71.31,17.19
MCLK_OUT  (via drill 0.2 pad 0.25)
  Top 0.2: v67.13,8.76 66.61,8.76 66.11,8.26 66.11,6.9 U6.3
  Bottom 0.2: 67.98,8.76 v67.13,8.76
  Bottom 0.203: R45.2 R43.1 67.98,8.76
  Bottom 0.24: R43.1 R44.1
MCLK_XCORE0  (via drill 0.2 pad 0.25)
  Top 0.2: v64.64,20.88 64.37,20.61 U3.63
  Bottom 0.2: v64.64,20.88 65.22,20.3 65.22,12.69 65.58,12.32 67.83,12.32 69.33,10.82 R45.1
MCLK_XCORE1  (via drill 0.2 pad 0.25)
  Top 0.203: U3.13 54.33,6.22 v54.96,5.59
  Bottom 0.2: R44.2 69.33,6.24 65.12,2.03 59.98,2.03 57.51,4.5 56.47,4.5 55.49,5.48 55.07,5.48 v54.96,5.59
N$2
  Bottom 0.2: U4.3 56.59,33.98 56.59,33.97 58.37,32.66 R22.2 59.51,31.96 R21.1
N$3
  Top 0.203: U2.2 38.26,20.11 38.65,20.5 40.78,20.5 L1.1
N$4
  Bottom 0.305: J1.MH1 R1.2
N$5
  Top 0.152: U3.99 48.92,20.21 49.05,20.33 49.05,23.56 48.49,24.11 R30.2
N$6  (via drill 0.2)
  Top 0.2: C6.1 37.18,9.78 36.47,9.78 v36.39,9.7
  Top 0.203: C6.1 R7.1 36.26,11.91 U2.24
  Bottom 0.2: v36.39,9.7 34.79,8.1 R4.1 | J1.19 27.8,15.25 27.8,9 28.7,8.1 R4.1 | R4.1
N$7
  Bottom 0.61: R8.1 R9.2 2.5,36.79 U1.4
N$8
  Bottom 0.2: R3.1 28.4,7.45 26.2,9.65 J1.18
N$9
  Top 0.2: U2.4 37.46,23.53 37.71,23.78 37.77,23.78 X1.3 39.5,24.53 C21.1
N$10
  Top 0.2: U2.5 37.06,22.18 X1.1 35.36,22.93 C22.1
N$13
  Top 0.203: U2.31 40.63,15.04 R12.1
N$14
  Top 0.2: U2.21 35.06,12.64 | C7.1 29.97,7.19 J1.17
  Top 0.203: C7.1 32.51,10.95 R10.1 33.21,11.7 34.12,11.7 35.06,12.64
N$15
  Bottom 0.305: J1.12 C1.2
N$16
  Top 0.2: Y1.3 68.82,12.29 R41.1 R42.1
N$18
  Bottom 0.305: J1.6 21.12,20.36 C2.2
N$19
  Top 0.2: R41.2 66.84,12.3 66.83,12.29 66.6,12.06 U6.7
N$20
  Top 0.203: U2.7 36.26,20.87 35.85,21.28 34.91,21.28 R11.2
N$23
  Top 0.61: L2.1 48.98,36.94 47.48,35.44 U7.3
N$24
  Top 0.2: U3.28 60.33,6.09 59.82,5.58 59.82,4.43 59.94,4.31 IC1.6
N$25
  Top 0.254: Y1.1 70.57,6.88 R38.2
N$26
  Top 0.2: IC1.5 60.63,4.81 61.53,5.71 U3.31
N$28
  Top 0.2: U3.33 63.4,7.04 62.71,6.35 62.71,3.97 62.87,3.81 IC1.2
N$29
  Top 0.61: L3.1 65.44,35.37 62.32,35.37 U10.3
N$30
  Top 0.2: U3.34 63.42,8.98 64.23,8.98 64.39,8.83 64.39,7.32 64.17,7.1 64.17,4.55 63.93,4.31 IC1.3
N$35
  Top 0.203: U3.112 45.95,15.01 R20.2
N$42
  Top 0.2: IC1.7 60.49,3.8 60.88,3.8 61.27,4.19 61.27,4.94 62.32,5.99 62.32,6.52 62.41,6.61 62.41,9.23 62.59,9.41 U3.35
N$43  (via drill 0.2)
  Top 0.203: U3.10 53.13,5.56 53.74,4.94 v53.95,4.94
  Bottom 0.2: R24.1 51.2,5.34 51.48,5.06 52.19,5.06
  Bottom 0.203: v53.95,4.94 52.3,4.94 52.19,5.06
N$44  (via drill 0.2)
  Top 0.203: U3.12 53.93,6.09 53.74,5.9 53.74,5.83 v53.78,5.79
  Bottom 0.203: v53.78,5.79 53.94,5.79 54.59,5.14 54.59,3.37 R25.1
N$54  (via drill 0.2)
  Top 0.2: U2.22 35.46,13.29 35.9,12.86 35.9,11.34 R6.1 | C5.1 34.74,8.96 v33.38,8.96
  Top 0.203: R6.1 C5.1
  Bottom 0.2: J1.20 26.21,19.39 28.5,17.1 28.5,9.3 29,8.8 31.45,8.8 R5.1 33.17,8.75 v33.38,8.96
N$56
  Bottom 0.305: J1.1 C3.2
N$58
  Bottom 0.305: J1.7 23.66,4.83 C4.2
N$64
  Bottom 0.305: J1.MH2 R2.2
N$77
  Top 0.203: U3.123 45.04,10.61 R23.2
N$79
  Bottom 0.2: U4.5 55.94,31.61 56.5,31.05 C25.1
N$82
  Top 0.61: R55.2 62,32.54 62.21,32.75 62.21,33.36 U10.1 63.05,33.44 R54.1
N$85
  Bottom 0.2: U8.5 52.14,30.89 C51.1
N$88
  Top 0.508: R50.2 44.51,32.34 U7.1
  Top 0.61: U7.1 45.65,33.54 R49.1
N$89
  Top 0.203: LED2.A 37.04,30.98 R52.1
PHY_INT  (via drill 0.2, 0.2 pad 0.25)
  Top 0.2: v57.74,24.22 57.77,24.22 58.33,23.66 U3.74 | U2.20 33.98,15.04
  Top 0.203: 33.98,15.04 33.79,14.85 33.79,14.06 v34.39,13.46
  Bottom 0.2: v57.74,24.22 57.2,24.77 | R17.1 33.03,10.7 37.62,10.7 39.02,9.3 39.36,9.3 39.35,9.3 40.36,9.3 41.5,10.43 44.7,10.43 45.24,10.97 45.24,19.73 50.27,24.77
  Bottom 0.203: 57.2,24.77 50.27,24.77 | v34.39,13.46 34.23,13.46 33.72,12.96 33.72,11.44 33.39,11.11 32.88,11.11 32.88,11.06 R17.1
PHY_MDC  (via drill 0.2 pad 0.25)
  Top 0.2: U2.40 39.7,18.64
  Top 0.203: v40.21,19.28 40.21,19.15 39.7,18.64 | v44.17,11.01 44.22,11.01 44.59,11.39 46.43,11.39 46.81,11.01 U3.122
  Bottom 0.203: v40.21,19.28 41.28,19.28 42.96,17.6 42.96,13.03 44.17,11.82 v44.17,11.01
PHY_MDIO  (via drill 0.2 pad 0.25)
  Top 0.2: U3.121 47.19,11.41 46.76,11.83 44.12,11.83 43.82,11.53 v43.26,11.53 | R15.1 43.2,11.6 43.2,11.59 | U2.39 40.22,18.24
  Top 0.203: 40.22,18.24 v40.44,18.47 | 43.2,11.59 v43.26,11.53
  Bottom 0.203: v40.44,18.47 41.59,18.47 42.45,17.6 42.45,12.78 43.26,12.1 v43.26,11.53
PHY_RSTN  (via drill 0.2, 0.2 pad 0.25)
  Top 0.2: v58.5,24.42 58.58,24.34 58.58,24.06 59.13,23.51 U3.72
  Top 0.203: U2.1 38.66,19.89 v39.4,19.89
  Bottom 0.2: 45.95,21.84 45.95,24.49 45.95,24.6 | 45.95,24.6 45.95,24.7 | 48.93,25.32 48.3,24.7 47.11,24.7 47.13,24.68 47.43,24.68 C24.1 45.97,24.57 45.95,24.6 | R18.2 45.95,24.6 | 45.95,24.6
  Bottom 0.203: 45.95,21.84 43.99,19.89 v39.4,19.89 | v58.5,24.42 58.39,24.53 58.39,24.9 57.96,25.32 48.93,25.32 | 45.95,24.49 | 48.3,24.7 47.43,24.68
PLL_AVDD  (via drill 0.2)
  Top 0.2: U3.103 49.74,18.6 51.64,16.7 v51.64,15.87
  Bottom 0.2: R16.1 51.66,15.9
  Bottom 0.203: 51.66,15.9 v51.64,15.87 51.66,15.85 C23.1
PLL_SYNC  (via drill 0.2 pad 0.25)
  Top 0.2: U3.30 61.13,7.99 61.49,8.35 v61.8,8.35 | v67.13,7.92 67.13,6.92 U6.5
  Bottom 0.203: v67.13,7.92 66.47,8.59 62.04,8.59 v61.8,8.35
POR_N  (via drill 0.2, 0.2 pad 0.25)
  Top 0.2: v46.43,19.42 46.43,26.95 v46.36,27.02
  Top 0.203: v37.8,8.71 37.68,8.58 R34.1
  Top 0.24: U5.1 v37.8,8.71
  Bottom 0.2: v37.8,8.71 40.6,8.71 41.88,9.98 44.93,9.98 45.82,10.87 45.82,18.41 46.43,19.02 v46.43,19.42 | v46.36,27.02 46.36,27.11 47.42,28.17 57.1,28.17 57.45,28.51 57.45,30.6 56.59,31.46 U4.4
RST_N
  Top 0.2: R23.1 44.24,8.51 44.17,8.58 R37.1 44.04,8.51 | U5.4 41,7.4 40.54,7.4 40.17,7.76 40.17,8.33 40.55,8.71 U5.6 41.52,8.71
  Top 0.203: U3.124 45.97,10.21 45.2,9.43 R23.1 | 41.52,8.71 42.29,7.94 43.47,7.94 44.04,8.51
RX_CLK
  Top 0.2: U3.114 42.76,14.21
  Top 0.203: 42.76,14.21 R12.2
RX_D0
  Top 0.2: U2.29 38.26,13.66
  Top 0.203: 38.26,13.66 38.52,13.41 U3.116
RX_D1
  Top 0.2: 38.41,13.01 U3.117
  Top 0.203: 38.41,13.01 37.86,13.55 U2.28
RX_D2
  Top 0.2: R13.1 40.21,12.61
  Top 0.203: 40.21,12.61 U3.118 | R13.1 39.91,12.31 37.41,12.31 37.06,12.65 U2.26
RX_D3
  Top 0.2: 41.41,12.21 U3.119
  Top 0.203: U2.25 36.66,12.44 37.41,11.7 40.9,11.7 R14.1 41.41,12.21
RX_DV
  Top 0.2: U2.30 38.66,13.95
  Top 0.203: 38.66,13.95 38.8,13.81 39.64,13.81 39.66,13.79 39.67,13.81 U3.115
SCL  (via drill 0.2)
  Top 0.2: U3.37 65.35,10.21 65.64,10.5 65.64,11.07 U6.9 65.64,11.15 65.64,11.86 67.03,13.25 v70.76,13.25 | v76.52,15.68 77.83,15.68 X3.24
  Bottom 0.2: v76.52,15.68 76.41,15.68 73.12,12.39 71.64,12.39 70.78,13.25 v70.76,13.25 71.34,13.83 R40.2
SCLK
  Top 0.2: R27.1 63.13,24.09 62.69,23.64 61.78,23.64 61.53,23.39 U3.66
SCLK_OUT
  Top 0.2: R27.2 68.6,24.75 74,19.34 74.7,19.34 74.72,19.33 X3.17
SDA  (via drill 0.2)
  Top 0.2: U3.38 65.14,10.61 65.14,11.07 U6.10 65.14,11.15 65.14,12.06 66.98,13.9 71.85,13.9 v72.75,13 | X3.23 73.78,16.25 73.78,16.24 v73.83,16.19
  Bottom 0.2: v73.83,16.19 74.39,15.63 74.39,14.64 v72.75,13 72.9,13.15 R39.2
SDIOA
  Top 0.152: U3.88 52.73,23.64 53.36,24.27 53.91,24.27 54.15,24.52 R28.1
SDIOA_OUT
  Top 0.2: R28.2 54.23,26.13 54.49,26.13 55.14,25.48 68.84,25.48 74.07,20.25 X3.15
SDIOB
  Top 0.152: U3.89 52.38,22.53 52.38,23.89 53.03,24.54 R29.1
SDIOB_I2S_OUT
  Top 0.2: R29.2 53.03,26.24 53.65,26.86 54.88,26.86 55.85,25.88 69.36,25.88 73.99,21.25 X3.13
SDIOC
  Top 0.152: 51.93,24.87 U3.90
  Top 0.24: 51.93,24.87 R32.1
SDIOC_IN
  Top 0.152: R32.2 51.89,26.23 | X3.11 75.01,22.37
  Top 0.2: 51.89,26.23 52.9,27.24 55.34,27.24 56.16,26.42 69.77,26.42 73.82,22.37 75.01,22.37
SDIOD
  Top 0.152: U3.91 51.53,23.84 50.72,24.64 R33.1
SDIOD_I2S_IN
  Top 0.2: R33.2 51.38,26.86 52.02,26.86 52.75,27.59 55.87,27.59 56.61,26.86 70.43,26.86 74.01,23.28 75.07,23.28 X3.9
SDIOE_OUT  (via drill 0.2)
  Top 0.2: v72.54,5.44 73.34,6.24 73.34,13.44 74.15,14.25 X3.27
  Bottom 0.2: R47.2 57.41,1.64 69.29,1.64 72.54,4.89 v72.54,5.44
SDIOF_IN  (via drill 0.2)
  Top 0.2: X3.29 74.33,13.25 73.88,12.8 73.88,6.2 v73.98,6.1
  Bottom 0.2: R48.2 56.01,1.36 56.23,1.14 69.52,1.14 73.98,5.6 v73.98,6.1
SPI_CS  (via drill 0.2)
  Top 0.152: U3.27 59.93,6.19 59.06,5.32 v59.06,5.13 59.06,4.31 R35.1
  Top 0.2: R35.1 59.07,4.18 58.37,3.48 58.37,2.57 59.35,1.59 63.09,1.59 63.42,1.92 64.16,1.92 64.38,2.14 64.38,2.92 63.99,3.31 IC1.1
TCK  (via drill 0.2)
  Top 0.2: U3.128 47.27,8.61 v47.27,7.78 v47.27,7.77
  Bottom 0.2: v47.27,7.77 46.02,6.52 44.58,6.52 43.47,5.41 39.42,5.41 39.1,5.09 39.1,1.77 39.76,1.12 47.28,1.12 J3.13
TDI
  Top 0.2: U3.2 49.93,6.16 51.29,4.8 52.56,4.8 53.33,4.03 53.33,1.93 52.92,1.52 50.32,1.52 49.92,1.92 J3.15
TDO
  Top 0.2: J3.14 48.65,5.64 49.53,6.52 U3.1
TMS
  Top 0.2: U3.127 47.14,9.01 46.59,8.46 46.59,7.23 47.38,6.44 J3.12
TRD1_N
  Top 0.15: U2.10 35.05,19.82 34.77,20.1 31.63,20.1 31.63,20.13 30.48,21.28 30.48,21.98 30.36,22.1 30.18,22.1 29.99,21.91 29.99,19.36 29.66,19.03 29.18,19.03 28.83,19.38 28.83,22.05 28.74,22.14 28.55,22.14 28.37,21.96 28.37,20.55 28.04,20.22 27.53,20.22 27.22,20.53 27.22,21.92 27.03,22.11 25.75,22.11 25.07,21.43 25.07,16.9 24.49,16.32 24.07,16.32 23.66,15.91 J1.10
TRD1_P
  Top 0.15: U2.9 35.47,19.85 34.88,20.44 31.75,20.44 30.78,21.4 30.78,22.11 30.49,22.4 30.02,22.4 29.66,22.04 29.66,19.49 29.52,19.35 29.31,19.35 29.14,19.52 29.14,22.16 28.86,22.44 28.42,22.44 28.06,22.08 28.06,20.67 27.91,20.52 27.66,20.52 27.53,20.65 27.53,22.06 27.17,22.42 25.64,22.42 24.76,21.54 24.76,17.04 24.37,16.65 24.08,16.65 23.66,17.07 J1.11
TRD2_N
  Top 0.15: J1.5 21.12,15.78 20.66,15.32 20.41,15.32 19.93,15.8 19.93,18.6 20.7,19.37 21.54,19.37 22.19,18.72 22.19,14.92 23.14,13.97 25.45,13.97 27.59,16.11 27.59,17.29 27.75,17.45 27.92,17.45 28.07,17.3 28.07,16.93 28.35,16.65 28.8,16.65 29.07,16.92 29.07,17.68 29.29,17.9 33.99,17.9 34.05,17.84 U2.13
TRD2_P
  Top 0.15: J1.4 20.98,14.31 19.63,15.66 19.63,18.73 20.57,19.67 21.66,19.67 22.49,18.84 22.49,15.07 23.29,14.27 25.33,14.27 27.26,16.2 27.26,17.38 27.63,17.75 28.04,17.75 28.37,17.42 28.37,17.05 28.47,16.95 28.68,16.95 28.77,17.04 28.77,17.85 29.12,18.2 34,18.2 33.96,18.24
  Top 0.2: 33.96,18.24 U2.12
TRD3_N
  Top 0.15: J1.2 21.96,11.08 22.37,11.08 22.67,11.37 22.67,13.04 22.86,13.24 23.34,13.24 23.52,13.06 23.52,12.53 23.78,12.27 24.33,12.27 24.6,12.54 24.6,13.1 24.81,13.31 24.98,13.31 25.17,13.12 25.17,11.68 25.48,11.37 26.83,11.37 27.19,11.73 27.19,14.43 27.4,14.64 27.58,14.64 27.78,14.44 27.78,12.19 28.05,11.92 28.53,11.92 28.93,12.32 28.93,15.5 29.62,16.19 33.04,16.19 33.49,16.64 U2.16
TRD3_P
  Top 0.15: J1.3 22.01,11.38 22.22,11.38 22.35,11.51 22.35,13.17 22.72,13.54 23.46,13.54 23.83,13.17 23.83,12.69 23.95,12.57 24.18,12.57 24.3,12.69 24.3,13.22 24.7,13.62 25.09,13.62 25.47,13.24 25.47,11.84 25.63,11.68 26.69,11.68 26.88,11.87 26.88,14.55 27.27,14.94 27.73,14.94 28.09,14.58 28.09,12.33 28.2,12.22 28.41,12.22 28.63,12.44 28.63,15.62 29.5,16.49 32.9,16.49 33.43,17.02 34.39,17.02 U2.15
TRD4_N
  Top 0.15: U2.19 33.85,15.44 32.66,14.25 30.12,14.25 29.78,13.91 29.78,9.97 29.46,9.65 28.79,9.65 28.5,9.94 28.5,10.59 28.35,10.74 25.67,10.74 25.08,10.15 25.08,6.21 24.55,5.68 22.76,5.68 22.24,6.2 22.24,10.38 22.42,10.56 22.96,10.56 J1.9
TRD4_P
  Top 0.15: U2.18 33.74,15.84 32.5,14.6 29.91,14.6 29.46,14.15 29.46,10.07 29.34,9.95 28.93,9.95 28.81,10.07 28.81,10.8 28.55,11.06 25.54,11.06 24.76,10.28 24.76,6.38 24.37,5.99 22.93,5.99 22.58,6.34 22.58,10.24 23.3,10.24 23.59,9.95 23.59,9.3 J1.8
TX_CLK
  Top 0.2: R20.1 43.82,15.84
  Top 0.203: 43.82,15.84 U2.33
TX_D0
  Top 0.2: U2.34 46.45,16.24
  Top 0.203: 46.45,16.24 46.48,16.2 U3.109
TX_D1
  Top 0.2: U2.35 46.44,16.64
  Top 0.203: 46.44,16.64 46.47,16.6 U3.108
TX_D2
  Top 0.2: U3.107 46.5,17 | U2.36 46.47,17.04
  Top 0.203: 46.47,17.04 46.5,17
TX_D3
  Top 0.2: U3.106 46.5,17.41
  Top 0.203: U2.37 46.48,17.44 46.5,17.41
TX_EN
  Top 0.2: U2.32 42.83,15.44
  Top 0.203: U3.113 43.67,14.61 42.83,15.44
VC1+
  Bottom 0.61: U1.5 2.48,26.24 U1.6 | B2.+ 11.9,33.34 9.33,33.34 8.17,34.5 B1.+
  Bottom 1.27: 2.48,26.24 2.48,29.23 B1.+ | U1.5 U1.6
VC1-
  Bottom 0.61: B2.- 14.89,35.93 11.81,35.93 10.8,34.92 B1.-
  Bottom 1.27: U1.8 U1.7 18.32,26.3 18.32,32.65 16.15,34.83 B2.-
VC12
  Bottom 1.27: J1.13 14.01,14.98 16.19,17.16 16.19,22.97 15.31,23.85 JP1.1 15.31,28.05 B2.~1
VC36
  Bottom 0.508: 12.7,26.37 JP1.2
  Bottom 1.27: J1.14 13.96,18.93 13.96,22 12.7,23.26 12.7,26.37 | JP1.2 12.77,28.11 B2.~2
VC45
  Bottom 1.27: J1.15 12.47,15.12 9.57,18.02 9.57,20.74 7.69,22.62 JP1.4 7.69,26.74 6.4,28.04 6.4,29.62 7.32,30.54 9.17,30.54 10.77,28.94 B1.~1
VC78
  Bottom 0.2: B1.~2 8.17,28.77
  Bottom 0.508: 10.2,26.27 JP1.3 10.23,26.76
  Bottom 1.016: JP1.3 10.23,26.89 10.07,27.05 10.07,26.87 8.17,28.77
  Bottom 1.27: J1.16 11.47,19.88 11.47,21.68 10.2,22.95 10.2,26.27
VDC
  Top 1.27: U1.1 20.85,37.34 26.18,37.34 27.41,36.11 C9.1 27.46,35.06 C30.1 27.47,32.13 | C57.1 27.48,27.85 C58.1 27.52,30.27 C56.1 27.47,32.13 | FL2.2 31.62,32.14 27.48,32.14 27.47,32.13
  Bottom 0.61: R8.2 4.42,33.35 8.36,37.29 U1.2
  Bottom 1.27: U1.2 U1.1
VDDH_REG  (via drill 0.2, 0.2 pad 0.25)
  Top 0.2: v35.69,20.62 35.69,20.46 35.87,20.29 U2.8
  Top 0.203: v37.67,12.9 37.46,13.12 U2.27 | v34.29,12.7 33.97,12.37 33.5,12.37 C16.1
  Top 0.305: C16.1 32.54,11.75 31.95,11.75 R10.2
  Top 0.508: v35.34,11.9 35.09,11.9 34.75,11.57 34.75,11.49 R6.2 | R7.2 39.85,10.95 R13.2 40.24,11.06 | R15.2 41.94,10.68 R14.2 40.8,11.06 40.24,11.06 | v40.15,10.24 40.15,10.97 40.24,11.06
  Bottom 0.2: 40.19,10.39 40.19,10.29 v40.15,10.24
  Bottom 0.508: 35.97,12.9 35.34,12.27 v35.34,11.9 34.66,12.59 34.4,12.59 v34.29,12.7 | 35.97,12.9 34.83,14.05 34.83,19.76 v35.69,20.62 | 35.97,12.9 v37.67,12.9
  Bottom 0.61: C19.1 35.69,21.65 v35.69,20.62 | v37.67,12.9 40.19,10.39
X1D04
  Top 0.2: U3.75 57.93,23.43 57.84,23.52 57.63,23.52 57.14,24.02 57.14,24.47 57.48,24.81 57.98,24.81 58.16,24.99 59.86,24.99 R46.1
X1D36  (via drill 0.2)
  Top 0.2: v55.31,4.71 55.53,4.93 55.53,5.9 55.13,6.3 U3.15
  Bottom 0.2: v55.31,4.71 55.31,3.96 56.01,3.26 R48.1
X1D37  (via drill 0.2)
  Top 0.2: v56,4.09 56.02,4.11 56.02,5.91 56.33,6.22 U3.18
  Bottom 0.2: v56,4.09 56.26,4.09 R47.1
XL_DN0
  Top 0.2: J3.7 46.2,1.13 53.21,1.13 54.12,2.04 54.12,3.95 52.73,5.34 U3.9
XL_DN1  (via drill 0.2)
  Top 0.152: v51.71,5.61 51.77,5.61
  Top 0.2: U3.8 52.33,6.17 51.77,5.61
  Bottom 0.2: v51.71,5.61 51.24,6.08 44.94,6.08 43.57,4.71 J3.6
XL_UP0
  Bottom 0.2: J3.8 44.84,5.13 45.05,5.34 R24.2
XL_UP1  (via drill 0.2)
  Top 0.2: J3.9 47.05,1.55 48.99,1.55 49.14,1.7 v49.28,1.7
  Bottom 0.2: R25.2 54.11,1.85 53.38,1.12 49.83,1.12 49.28,1.67 v49.28,1.7
XSYS_RST_N  (via drill 0.2)
  Top 0.2: v39.73,4.79 38.96,5.56 38.96,7.34 U5.3 37.03,7.39
  Top 0.24: R36.1 37.03,7.39
  Bottom 0.2: J3.11 47.38,2.13 46.77,1.52 39.97,1.52 39.51,1.98 39.51,4.57 v39.73,4.79